# Altium schematic sheet Dogfish3D - Z Driver.SchDoc
size A
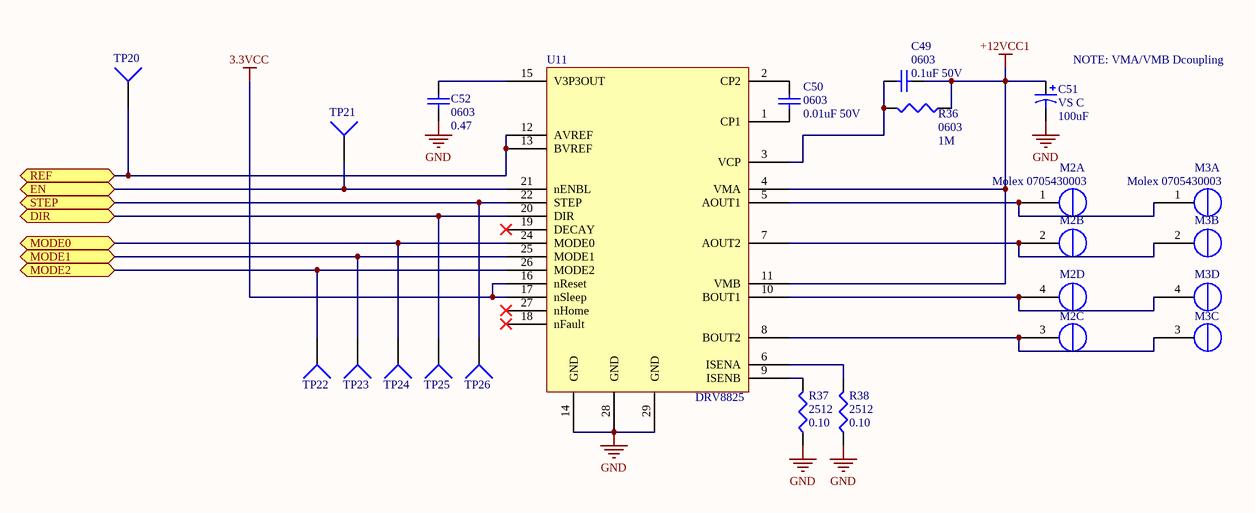
[diagram p0: Dogfish3D - Z Driver.SchDoc]

## Parts
C49  0603  value 0.1uF 50V  [1608[0603]]
C50  0603  value 0.01uF 50V  [1608[0603]]
C51  VS C  value 100uF  [Panasonic VS C]
C52  0603  value 0.47  [1608[0603]]
M2  Molex 0705430003  [4POL254]  (parts A,B,C,D of 4)
M3  Molex 0705430003  [4POL254]  (parts A,B,C,D of 4)
R36  0603  value 1M  [J1-0603]
R37  2512  value 0.10  [Resistor2512]
R38  2512  value 0.10  [Resistor2512]
TP20  TP4  [TP-2]  (value not drawn)
TP21  TP4  [TP-2]  (value not drawn)
TP22  TP4  [TP-2]  (value not drawn)
TP23  TP4  [TP-2]  (value not drawn)
TP24  TP4  [TP-2]  (value not drawn)
TP25  TP4  [TP-2]  (value not drawn)
TP26  TP4  [TP-2]  (value not drawn)
U11  DRV8825  [DRV8825]

## Ports
DIR, EN, MODE0, MODE1, MODE2, REF, STEP

## Nets
3.3VCC: U11.16(nReset) U11.17(nSleep)
+12VCC1: C49.1 C51.1 R36.1 U11.4(VMA) U11.11(VMB)
GND: C51.2 C52.1 R37.1 R38.1 U11.14(GND) U11.28(GND) U11.29(GND)
DIR: TP25.1 U11.20(DIR) ; port DIR
EN: TP21.1 U11.21(nENBL) ; port EN
MODE0: TP24.1 U11.24(MODE0) ; port MODE0
MODE1: TP23.1 U11.25(MODE1) ; port MODE1
MODE2: TP22.1 U11.26(MODE2) ; port MODE2
REF: TP20.1 U11.12(AVREF) U11.13(BVREF) ; port REF
STEP: TP26.1 U11.22(STEP) ; port STEP
NetC49_2: C49.2 R36.2 U11.3(VCP)
NetC50_1: C50.1 U11.1(CP1)
NetC50_2: C50.2 U11.2(CP2)
NetC52_2: C52.2 U11.15(V3P3OUT)
NetM2_1: M2.1(OUT2B) M3.1(OUT2B) U11.5(AOUT1)
NetM2_2: M2.2(OUT2A) M3.2(OUT2A) U11.7(AOUT2)
NetM2_3: M2.3(OUT1A) M3.3(OUT1A) U11.8(BOUT2)
NetM2_4: M2.4(OUT1B) M3.4(OUT1B) U11.10(BOUT1)
NetR37_2: R37.2 U11.9(ISENB)
NetR38_2: R38.2 U11.6(ISENA)

Not connected (* = marked no-connect by the designer): U11 18(nFault)* 19(DECAY)* 23(NC) 27(nHome)*

## Notes on the sheet
- (near C51) NOTE: VMA/VMB Dcoupling

## Library data of the parts
C49 C50 C52 = Cap Semi: Capacitor (Semiconductor SIM Model); Published: 8-Jun-2000; LatestRevisionDate: 29-May-2009; LatestRevisionNote: IPC-7351 Footprint Added.; PackageReference: C1206; Publisher: Altium Limited; PackageDescription: Chip Capacitor
C51 = Cap Pol1: Polarized Capacitor (Radial); Published: 8-Jun-2000; LatestRevisionDate: 17-Jul-2002; LatestRevisionNote: Re-released for DXP Platform.; PackageReference: RB7.6-15; Publisher: Altium Limited; PackageDescription: Polarized Capacitor (Radial); 2 Leads
M2 M3 = Molex 0705430003 Alt: Molex 4 Pin Clip Connector
R36-R38 = Res3: Resistor; Published: 8-Jun-2000; LatestRevisionDate: 29-May-2009; LatestRevisionNote: IPC-7351 Footprint Added.; PackageReference: J1-0603; Publisher: Altium Limited; PackageDescription: Chip Resistor
TP20-TP26 = Socket: LatestRevisionDate: 17-Jul-2002; LatestRevisionNote: Re-released for DXP Platform.; Publisher: Altium Limited
U11 = DRV8825: DRV8825 Ti Stepper Driver